# EasyEDA schematic joystick-schematic.json
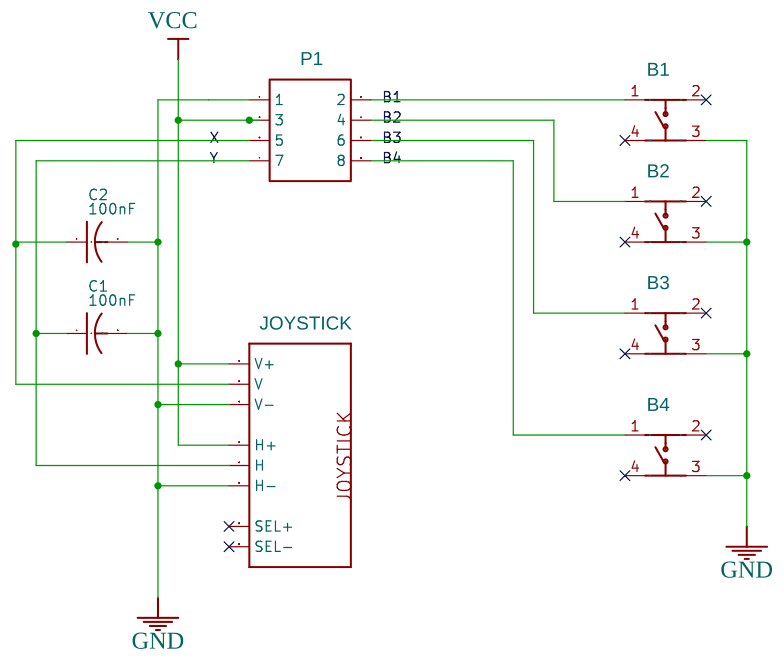
[diagram p0: schematic sheet]

## Parts
C1  100nF  [RAD-0.1]
C2  100nF  [RAD-0.1]
KEY1  B1  [KEY-TH_4P-L6.0-W6.0-P4.50-LS7.5]
KEY2  B2  [KEY-TH_4P-L6.0-W6.0-P4.50-LS7.5]
KEY3  B3  [KEY-TH_4P-L6.0-W6.0-P4.50-LS7.5]
KEY4  B4  [KEY-TH_4P-L6.0-W6.0-P4.50-LS7.5]
P1  HDR-IDC-2.54-2X4P  [IDC-TH_8P-P2.54-V-R2-C4-S2.54]
U1  JOYSTICK  [JOYSTICK]

## Library data of the parts
C1 C2 = -: Supplier: LCSC; Supplier Part: C154503
KEY1-KEY4 = -: Supplier Part: C110153; Supplier: LCSC; image: http://image.lceda.cn/szlcsc/C59982.jpg
P1 = -: Supplier: LCSC; Manufacturer: BOOMELE; Manufacturer Part: IDC Box 2X4 2.54MM; image: //image.lceda.cn/szlcsc/C9135.jpg; Supplier Part: C9135
U1 = -: Thumb Joystick; Contributor: SparkFun; Supplier: Digi-Key; Supplier Part: 1568-1526-ND

## Nets
GND: C1.2 C2.2 KEY1.3 KEY2.3 KEY3.3 KEY4.3 P1.1 U1.H3(H-) U1.V3(V-)
VCC: P1.3 U1.H1(H+) U1.V1(V+)
B1: KEY1.1 P1.2
B2: KEY2.1 P1.4
B3: KEY3.1 P1.6
B4: KEY4.1 P1.8
X: C2.1 P1.5 U1.V2(V)
Y: C1.1 P1.7 U1.H2(H)

Not connected (* = marked no-connect by the designer): KEY1 2* 4*; KEY2 2* 4*; KEY3 2* 4*; KEY4 2* 4*; U1 B1A(SEL+)* B2A(SEL-)*
